# Altium schematic sheet IO Peripherals.SchDoc
size A4; Revision: C.2(PCB.SCH)
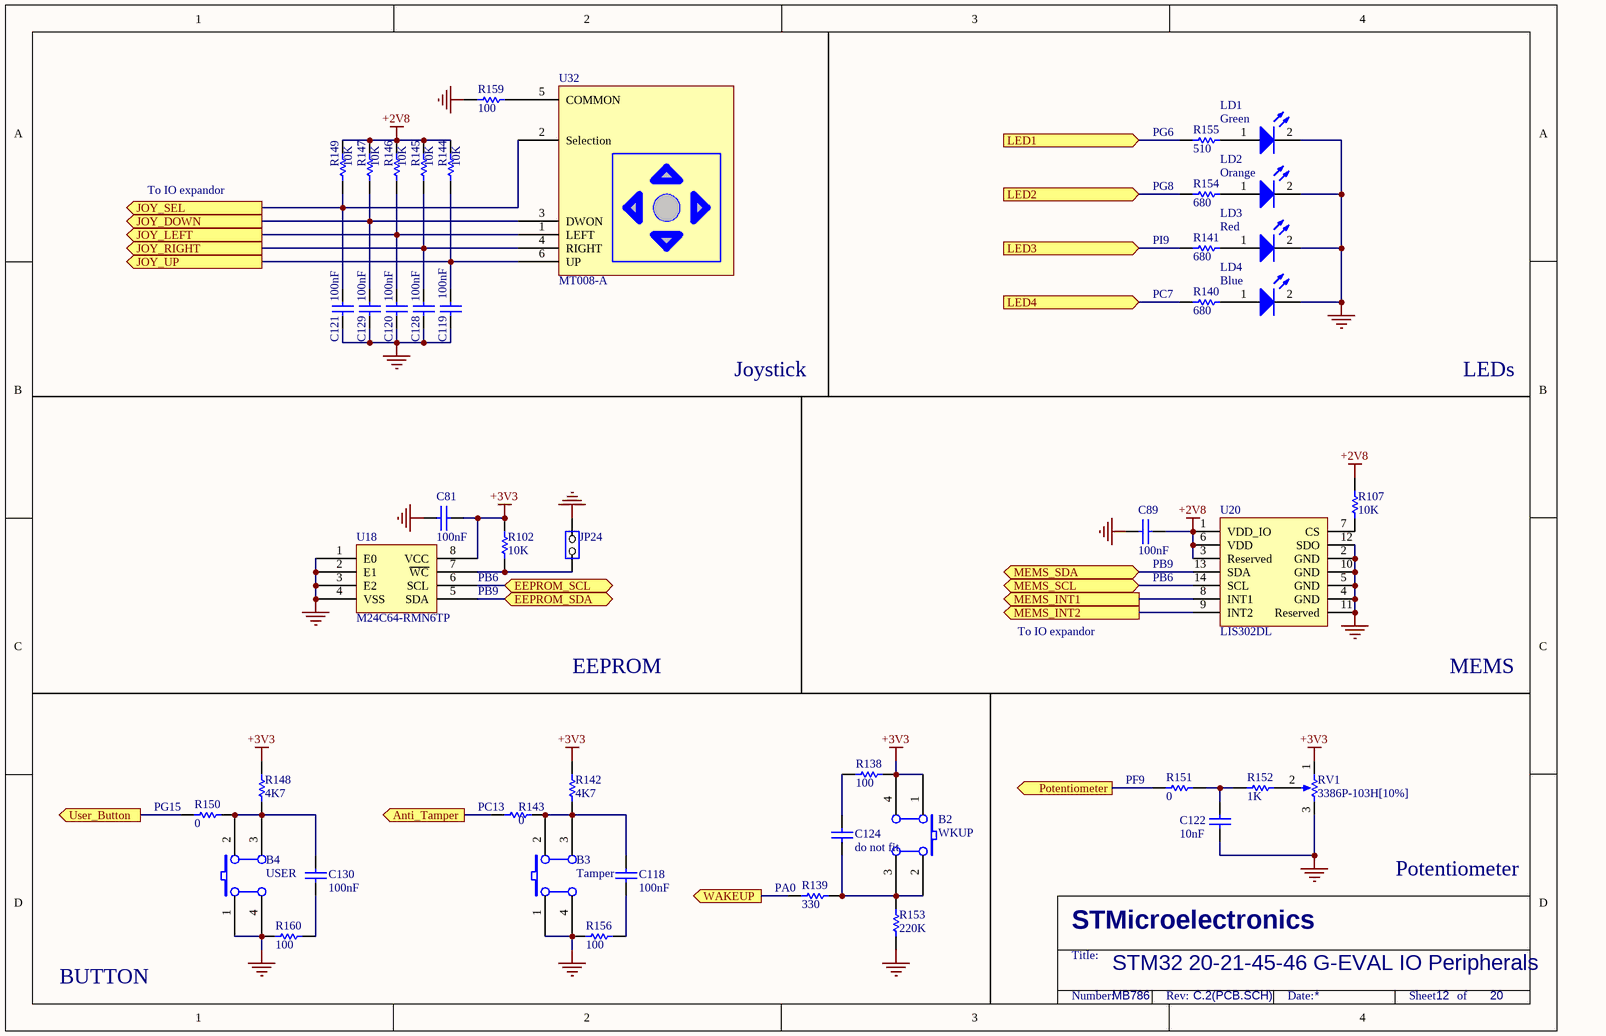
[diagram p0: IO Peripherals.SchDoc]

## Parts
B2  WKUP  [PB10]
B3  Tamper  [PB10]
B4  USER  [PB10]
C81  100nF  [0402C]
C89  100nF  [0402C]
C118  100nF  [0402C]
C119  100nF  [0402C]
C120  100nF  [0402C]
C121  100nF  [0402C]
C122  10nF  [0402C]
C124  do not fit  [0603C]
C128  100nF  [0402C]
C129  100nF  [0402C]
C130  100nF  [0402C]
JP24  (no value)  [SIP2]
LD1  Green  [0603D]
LD2  Orange  [0603D]
LD3  Red  [0603D]
LD4  Blue  [0603D]
R102  10K  [0402R]
R107  10K  [0402R]
R138  100  [0603R]
R139  330  [0603R]
R140  680  [0603R]
R141  680  [0603R]
R142  4K7  [0402R]
R143  0  [0603R]
R144  10K  [0402R]
R145  10K  [0402R]
R146  10K  [0402R]
R147  10K  [0402R]
R148  4K7  [0402R]
R149  10K  [0402R]
R150  0  [0603R]
R151  0  [0603R]
R152  1K  [0603R]
R153  220K  [0603R]
R154  680  [0603R]
R155  510  [0603R]
R156  100  [0603R]
R159  100  [0603R]
R160  100  [0603R]
RV1  3386P-103H[10%]  [3296W]
U18  M24C64-RMN6TP  [SO8]
U20  LIS302DL  [LGA14(3*5)]
U32  MT008-A  [JOY]

## Ports
Anti_Tamper (out), EEPROM_SCL (bidir), EEPROM_SDA (bidir), JOY_DOWN (out), JOY_LEFT (out), JOY_RIGHT (out), JOY_SEL (out), JOY_UP (out), LED1 (in), LED2 (in), LED3 (in), LED4 (in), MEMS_INT1 (out), MEMS_INT2 (out), MEMS_SCL (bidir), MEMS_SDA (bidir), Potentiometer (out), User_Button (out), WAKEUP (out)

## Nets
+2V8: C89.2 R107.1 R144.2 R145.2 R146.2 R147.2 R149.1 U20.1(VDD_IO) U20.3(Reserved) U20.6(VDD)
+3V3: B2.1(A0) B2.4(A1) C81.2 R102.1 R138.1 R142.2 R148.2 RV1.1(TOP) U18.8(VCC)
GND: B3.1(A0) B3.4(A1) B4.1(A0) B4.4(A1) C81.1 C89.1 C119.1 C120.1 C121.1 C122.1 C128.1 C129.1 JP24.2(NO) LD1.2(K) LD2.2(K) LD3.2(K) LD4.2(K) R153.2 R156.1 R159.1 R160.1 RV1.3(BOT) U18.1(E0) U18.2(E1) U18.3(E2) U18.4(VSS) U20.2(GND) U20.4(GND) U20.5(GND) U20.10(GND) U20.11(Reserved) U20.12(SDO)
Anti_Tamper: R143.2 ; port Anti_Tamper
EEPROM_SCL: U18.6(SCL) ; port EEPROM_SCL
EEPROM_SDA: U18.5(SDA) ; port EEPROM_SDA
JOY_DOWN: C129.2 R147.1 U32.3(DWON) ; port JOY_DOWN
JOY_LEFT: C120.2 R146.1 U32.1(LEFT) ; port JOY_LEFT
JOY_RIGHT: C128.2 R145.1 U32.4(RIGHT) ; port JOY_RIGHT
JOY_SEL: C121.2 R149.2 U32.2(Selection) ; port JOY_SEL
JOY_UP: C119.2 R144.1 U32.6(UP) ; port JOY_UP
LED1: R155.2 ; port LED1
LED2: R154.2 ; port LED2
LED3: R141.2 ; port LED3
LED4: R140.2 ; port LED4
MEMS_INT1: U20.8(INT1) ; port MEMS_INT1
MEMS_INT2: U20.9(INT2) ; port MEMS_INT2
MEMS_SCL: U20.14(SCL) ; port MEMS_SCL
MEMS_SDA: U20.13(SDA) ; port MEMS_SDA
Potentiometer: R151.1 ; port Potentiometer
User_Button: R150.2 ; port User_Button
WAKEUP: R139.2 ; port WAKEUP
NetB2_2: B2.2(B0) B2.3(B1) C124.2 R139.1 R153.1
NetB3_2: B3.2(B0) B3.3(B1) C118.2 R142.1 R143.1
NetB4_2: B4.2(B0) B4.3(B1) C130.2 R148.1 R150.1
NetC118_1: C118.1 R156.2
NetC122_2: C122.2 R151.2 R152.1
NetC124_1: C124.1 R138.2
NetC130_1: C130.1 R160.2
NetJP24_1: JP24.1(COMMON) R102.2 U18.7(~{WC})
NetLD1_1: LD1.1(A) R155.1
NetLD2_1: LD2.1(A) R154.1
NetLD3_1: LD3.1(A) R141.1
NetLD4_1: LD4.1(A) R140.1
NetR107_2: R107.2 U20.7(CS)
NetR152_2: R152.2 RV1.2(TAP)
NetR159_2: R159.2 U32.5(COMMON)

## Notes on the sheet
- (near R155) PG6
- To IO expandor
- (near R154) PG8
- (near R141) PI9
- (near R140) PC7
- Joystick
- LEDs
- (near R102) PB6
- (near C89) PB9
- PB6
- PB9
- EEPROM
- MEMS
- (near R151) PF9
- (near R150) PG15
- (near R143) PC13
- (near R139) PA0
- Potentiometer
- BUTTON
- STM32 20-21-45-46 G-EVAL IO Peripherals
- MB786
- 12
- 20
- STMicroelectronics
- Title:
- Number:
- Rev:
- Date:
- Sheet       of

## Library data of the parts
B2-B4 = SW PUSHBUTTON: SE PUSHBUTTON
C81 C89 = CAP: Capacitor
C118-C122 C124 C128-C130 = CAP: Capacitor; Value: 100pF; Published: 8-Jun-2000; Revision: July-2002: Re-released for DXP Platform.; Publisher: Altium Limited
JP24 = JP2
LD1-LD4 = LED2: Typical RED, GREEN, YELLOW, AMBER GaAs LED; Published: 8-Jun-2000; Revision: July-2002: Re-released for DXP Platform.; Publisher: Altium Limited
R102 R107 R142 R148 R153 = res1: Resistor; Value: 1K; Published: 8-Jun-2000; Revision: July-2002: Re-released for DXP Platform.; Publisher: Altium Limited
R138-R141 R143-R147 R149-R151 R154-R156 R159 R160 = Res1: Resistor; Value: 1K; Published: 8-Jun-2000; Revision: July-2002: Re-released for DXP Platform.; Publisher: Altium Limited
R152 = Res1: Resistor; Published: 8-Jun-2000; Revision: July-2002: Re-released for DXP Platform.; Publisher: Altium Limited; Value: 1K
RV1 = RV
U18 = M24C64-WMN6
U32 = MT-008A